# Altium project Zumo LF v2.0.PrjPcb (part 3 of 3)

## Sheet Battery Charger.SchDoc: Battery Charger
size A4; Author: Patryk Bujak; DrawnBy: Patryk Bujak; DocumentNumber: 12; Revision: 1.0; SheetNumber: 8; SheetTotal: 10
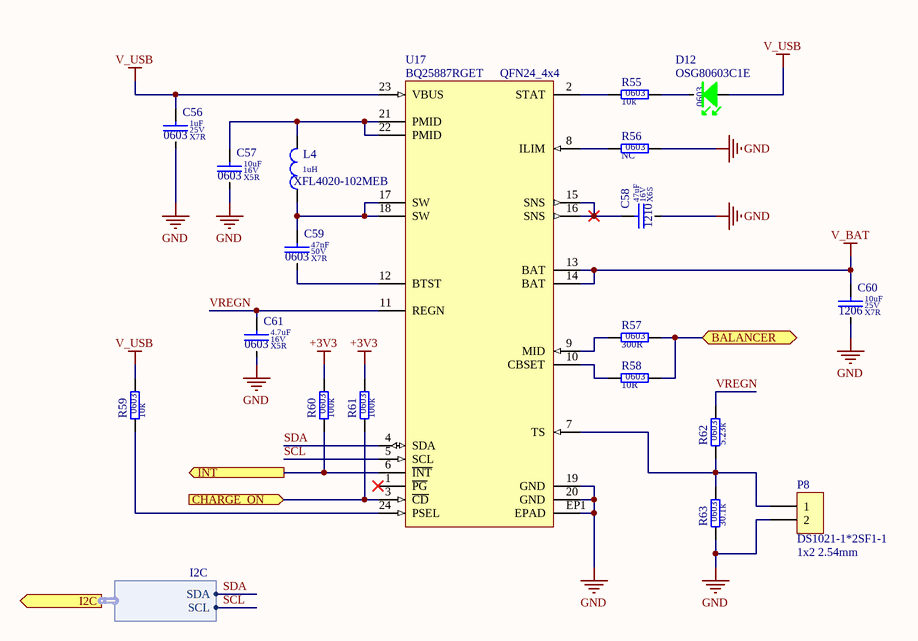
[diagram p9: Battery Charger.SchDoc]

### Parts
C56  value 1uF  Dielectric: X7R  Voltage: 25V  SCH_Footprint: 0603  [C_0603_1608]  (hidden comment: Ceramic X7R)
C57  value 10uF  Dielectric: X5R  Voltage: 16V  SCH_Footprint: 0603  [C_0603_1608]  (hidden comment: Ceramic X5R)
C58  value 47uF  Dielectric: X6S  Voltage: 16V  SCH_Footprint: 1210  [C_1210_3225]  (hidden comment: Ceramic X6S)
C59  value 47nF  Dielectric: X7R  Voltage: 50V  SCH_Footprint: 0603  [C_0603_1608]  (hidden comment: Ceramic X7R)
C60  value 10uF  Dielectric: X7R  Voltage: 25V  SCH_Footprint: 1206  [C_1206_3216]  (hidden comment: Ceramic X7R)
C61  value 4.7uF  Dielectric: X5R  Voltage: 16V  SCH_Footprint: 0603  [C_0603_1608]  (hidden comment: Ceramic X5R)
D12  value OSG80603C1E  SCH_Footprint: 0603  [OL_0603_1608]  (hidden comment: Green led)
L4  value 1uH  SCH_Footprint: XFL4020-102MEB  [XFL4020]  (hidden comment: Inductor)
P8  value DS1021-1*2SF1-1  SCH_Footprint: 1x2 2.54mm  [P_HEADER_1x2_2.54]  (hidden comment: Goldpin)
R55  value 10k  SCH_Footprint: 0603  [R_0603_1608]  (hidden comment: Resistor)
R56  value NC  SCH_Footprint: 0603  [R_NC_0603_1608]  (hidden comment: Resistor)
R57  value 300R  SCH_Footprint: 0603  [R_0603_1608]  (hidden comment: Resistor)
R58  value 10R  SCH_Footprint: 0603  [R_0603_1608]  (hidden comment: Resistor)
R59  value 10k  SCH_Footprint: 0603  [R_0603_1608]  (hidden comment: Resistor)
R60  value 100k  SCH_Footprint: 0603  [R_0603_1608]  (hidden comment: Resistor)
R61  value 100k  SCH_Footprint: 0603  [R_0603_1608]  (hidden comment: Resistor)
R62  value 5.23k  SCH_Footprint: 0603  [R_0603_1608]  (hidden comment: Resistor)
R63  value 30.1k  SCH_Footprint: 0603  [R_0603_1608]  (hidden comment: Resistor)
U17  value BQ25887RGET  [QFN24_4x4]  (hidden comment: BQ25887 I2C Controlled 2-Cell, 2-A Boost-Mode Battery Charger With Cell Balancing For USB Input)

### Ports
BALANCER (bidir), CHARGE_ON (in), I2C (out, harness I2C), INT (out)

### Harnesses
I2C: SDA, SCL

### Nets
+3V3: R60.2 R61.2
GND: C56.2 C57.2 C58.2 C60.2 C61.2 P8.2 R56.2 R63.1 U17.19(GND) U17.20(GND) U17.EP1(EPAD)
V_BAT: C60.1 U17.13(BAT) U17.14(BAT)
V_USB: C56.1 D12.2(A) R59.2 U17.23(VBUS)
SCL: U17.5(SCL) ; port I2C.SCL  [project net BCM3/SCL]
SDA: U17.4(SDA) ; port I2C.SDA  [project net BCM2/SDA]
VREGN: C61.1 R62.2 U17.11(REGN)
NetC57_1: C57.1 L4.2 U17.21(PMID) U17.22(PMID)
NetC58_1: C58.1 U17.15(SNS) U17.16(SNS)
NetC59_1: C59.1 L4.1 U17.17(SW) U17.18(SW)
NetC59_2: C59.2 U17.12(BTST)
NetD12_1: D12.1(K) R55.2
NetJ1_2: R57.2 R58.2 ; port BALANCER
NetP8_1: P8.1 R62.1 R63.2 U17.7(TS)
NetR55_1: R55.1 U17.2(STAT)
NetR56_1: R56.1 U17.8(ILIM)
NetR57_1: R57.1 U17.9(MID)
NetR58_1: R58.1 U17.10(CBSET)
NetR59_1: R59.1 U17.24(PSEL)
NetR60_1: R60.1 U17.6(~{INT}) ; port INT
NetR61_1: R61.1 U17.3(~{CD}) ; port CHARGE_ON

Not connected (* = marked no-connect by the designer): U17 1(~{PG})*

### Notes on the sheet
- Title
- Size:
- Date:
- A4
- Number:
- Time:
- Revision:
- Sheet
- of
- File:

### Library data of the parts
C56 = C_1uF_25V_X7R_0603_10: Capacitor; Manufacturer: Samsung; Manufacturer Part Number: CL10B105KA8NNNC; Tolerance (%): 10; Part Number: C_1uF_25V_X7R_0603_10; HelpURL: http://www.tme.eu/pl/Document/4a42202b32dab16128fe107dd69598cc/samsung-chip-cap.pdf; Supplier 1: TME; Supplier Part Number 1: CL10B105KA8NNNC; Supplier 2: RS Components; Supplier 3: Farnell; Supplier 4: Mouser; Supplier 5: Digi-Key; Supplier 6: LCSC
C57 = C_10uF_16V_X5R_0603_20: Capacitor; Manufacturer: Samsung Electro-Mechanics; Manufacturer Part Number: CL10A106MO8NQNC; Tolerance (%): 20; Part Number: C_10uF_16V_X5R_0603_20; HelpURL: http://www.tme.eu/pl/Document/4a42202b32dab16128fe107dd69598cc/samsung-chip-cap.pdf; Supplier 1: TME; Supplier Part Number 1: CL10A106MO8NQNC; Supplier 2: RS Components; Supplier 3: Farnell; Supplier 4: Mouser; Supplier 5: Digi-Key; Supplier 6: LCSC
C58 = C_47uF_16V_X6S_1210_10: Capacitor; Manufacturer: Murata; Manufacturer Part Number: GRM32EC81C476KE15L; Tolerance (%): 10; Part Number: C_47uF_16V_X6S_1210_10; HelpURL: https://datasheet.octopart.com/GRM32EC81C476KE15L-Murata-datasheet-138746852.pdf; Supplier 1: TME; Supplier 2: RS Components; Supplier Part Number 2: 8467369; Supplier 3: Farnell; Supplier Part Number 3: 1907527; Supplier 4: Mouser; Supplier Part Number 4: 81-GRM32EC81C476KE5L; Supplier 5: Digi-Key; Supplier Part Number 5: 490-10531-1-ND; Supplier 6: LCSC
C59 = C_47nF_50V_X7R_0603_10: Capacitor; Manufacturer: Vishay; Manufacturer Part Number: VJ0603Y473KXACW1BC; Tolerance (%): 10; Part Number: C_47nF_50V_X7R_0603_10; HelpURL: https://www.tme.eu/Document/6a5ad7ac81542ad65ce1ca82bcd21ffa/vjw1bcbascomseries.pdf; Supplier 1: TME; Supplier Part Number 1: VJ0603Y473KXACW1BC; Supplier 2: RS Components; Supplier 3: Farnell; Supplier Part Number 3: 2896456; Supplier 4: Mouser; Supplier Part Number 4: 77-VJ0603Y473KXACBC; Supplier 5: Digi-Key; Supplier Part Number 5: 720-1697-1-ND; Supplier 6: LCSC
C60 = C_10uF_25V_X7R_1206_10: Capacitor; Manufacturer: Samsung Electro-Mechanics; Manufacturer Part Number: CL31B106KAHNNNE; Tolerance (%): 10; Part Number: C_10uF_25V_X7R_1206_10; HelpURL: http://www.tme.eu/pl/Document/4a42202b32dab16128fe107dd69598cc/samsung-chip-cap.pdf; Supplier 1: TME; Supplier Part Number 1: CL31B106KAHNNNE; Supplier 2: RS Components; Supplier 3: Farnell; Supplier 4: Mouser; Supplier 5: Digi-Key; Supplier 6: LCSC
C61 = C_4.7uF_16V_X5R_0603_10: Capacitor; Manufacturer: Murata; Manufacturer Part Number: GRM188R61C475KAAJD; Tolerance (%): 10; Part Number: C_4.7uF_16V_X5R_0603_10; HelpURL: https://datasheet.octopart.com/GRM188R61C475KAAJD-Murata-datasheet-66077093.pdf; Supplier 1: TME; Supplier 2: RS Components; Supplier Part Number 2: 884-7264P; Supplier 3: Farnell; Supplier Part Number 3: 2611924; Supplier 4: Mouser; Supplier Part Number 4: 81-GRM188R61C475KAJD; Supplier 5: Digi-Key; Supplier Part Number 5: 490-10481-2-ND; Supplier 6: LCSC
D12 = OL_G_0603_OSG80603C1E: LED GREEN; Manufacturer: Optosupply; Part Number: OL_G_0603_OSG80603C1E; Manufacturer Part Number: OSG80603C1E; Supplier 1: TME; Supplier Part Number 1: OSG80603C1E; Supplier 2: RS Components; Supplier 3: Farnell; Supplier 4: Mouser; Supplier 5: Digi-Key; Supplier 6: LCSC
L4 = LM_1uH_11A_XFL4020-102MEB: Induction; Manufacturer: Coilcraft; Current: 11A; Resistance: 11.9mR; Part Number: LM_1uH_11A_XFL4020-102MEB; HelpURL: https://datasheet.octopart.com/XFL4020-102MEB-Coilcraft-datasheet-10792328.pdf; Manufacturer Part Number: XFL4020-102MEB; Supplier 1: TME; Supplier 2: RS Components; Supplier 3: Farnell; Supplier 4: Mouser; Supplier Part Number 4: 994-XFL4020-102MEB; Supplier 5: Digi-Key; Supplier 6: LCSC; Supplier 7: Coilcraft; Supplier Part Number 7: XFL4020-102MEB
P8 = P_HEADER_1x2_2.54: Pin Header; Manufacturer: Connfly; Part Number: P_HEADER_1x2_2.54; HelpURL: http://www.tme.eu/en/Document/cc301e58a5da78cb543a94b5a5b7f06a/DS1021.pdf; Manufacturer Part Number: DS1021-1*2SF1-1; Supplier 1: TME; Supplier Part Number 1: ZL201-02G; Supplier 2: RS Components; Supplier 3: Farnell; Supplier 4: Mouser; Supplier 5: Digi-Key; Supplier 6: LCSC
R55 R59 = R_10k_0603_1: Manufacturer: Vishay; Manufacturer Part Number: CRCW060310K0FKTABC; Voltage: 75V; Power: 100mW; Tolerance: 1%; Part Number: R_10k_0603_1; HelpURL: http://www.tme.eu/pl/Document/622e28308c06d160637f2b14751ba16b/Data%20Sheet%20CRCW_BCe3.pdf; Supplier 1: TME; Supplier Part Number 1: CRCW060310K0FKTABC; Supplier 2: RS Components; Supplier 3: Farnell; Supplier 4: Mouser; Supplier Part Number 4: 667-ERJ-3EKF1002V; Supplier 5: Digi-Key; Supplier Part Number 5: P10KGCT-ND; Supplier 6: LCSC
R56 = R_GENERIC_0603: Part Number: R_GENERIC_0603; Supplier 1: TME; Supplier 2: RS Components; Supplier 3: Farnell; Supplier 4: Mouser; Supplier 5: Digi-Key; Supplier 6: LCSC
R57 = R_300R_0603_1: Manufacturer: Yageo; Manufacturer Part Number: RC0603FR-07300RL; Voltage: 50V; Power: 100mW; Tolerance: 1%; Part Number: R_300R_0603_1; HelpURL: https://www.tme.eu/Document/d2a72e545e5c8eb7bf2a04fa97535928/rc0603yageo.pdf; Supplier 1: TME; Supplier Part Number 1: RC0603FR-07300R; Supplier 2: RS Components; Supplier 3: Farnell; Supplier Part Number 3: 2413696; Supplier 4: Mouser; Supplier Part Number 4: 603-RC0603FR-07300RL; Supplier 5: Digi-Key; Supplier Part Number 5: 311-300HRCT-ND; Supplier 6: LCSC
R58 = R_10R_0603_1: Manufacturer: Royalohm; Manufacturer Part Number: 0603SAF100JT5E; Voltage: 50V; Power: 100mW; Tolerance: 1%; Part Number: R_10R_0603_1; HelpURL: http://www.tme.eu/pl/Document/b315665a56acbc42df513c99b390ad98/ROYALOHM-THICKFILM.pdf; Supplier 1: TME; Supplier Part Number 1: SMD0603-10R-1%; Supplier 2: RS Components; Supplier 3: Farnell; Supplier 4: Mouser; Supplier 5: Digi-Key; Supplier 6: LCSC
R60 R61 = R_100k_0603_1: Manufacturer: Royalohm; Manufacturer Part Number: 0603SAF1003T5E; Voltage: 50V; Power: 100mW; Tolerance: 1%; Part Number: R_100k_0603_1; HelpURL: http://www.tme.eu/pl/Document/b315665a56acbc42df513c99b390ad98/ROYALOHM-THICKFILM.pdf; Supplier 1: TME; Supplier Part Number 1: SMD0603-100K-1%; Supplier 2: RS Components; Supplier 3: Farnell; Supplier 4: Mouser; Supplier Part Number 4: 667-ERJ-3EKF1003V; Supplier 5: Digi-Key; Supplier Part Number 5: P100KHCT-ND; Supplier 6: LCSC
R62 = R_5.23k_0603_1: Manufacturer: Royalohm; Manufacturer Part Number: 0603SAF5232T5E; Voltage: 50V; Power: 100mW; Tolerance: 1%; Part Number: R_5.23k_0603_1; HelpURL: https://www.tme.eu/Document/9e42ba54d36a9bd3dfa2901986ac022d/rezystor-smd.pdf; Supplier 1: TME; Supplier Part Number 1: SMD0603-52.3K-1%; Supplier 2: RS Components; Supplier 3: Farnell; Supplier 4: Mouser; Supplier 5: Digi-Key; Supplier 6: LCSC
R63 = R_30.1k_0603_1: Manufacturer: Vishay; Manufacturer Part Number: CRCW060330K1FKTABC; Voltage: 75V; Power: 100mW; Tolerance: 1%; Part Number: R_30.1k_0603_1; HelpURL: https://www.tme.eu/Document/622e28308c06d160637f2b14751ba16b/Data%20Sheet%20CRCW_BCe3.pdf; Supplier 1: TME; Supplier Part Number 1: CRCW060330K1FKTABC; Supplier 2: RS Components; Supplier 3: Farnell; Supplier 4: Mouser; Supplier Part Number 4: 71-CRCW0603-30.1K; Supplier 5: Digi-Key; Supplier Part Number 5: CRCW060330K1FKTA-ND; Supplier 6: LCSC
U17 = U_BQ25887RGET: Manufacturer: Texas Instruments; SCH_Footprint: QFN24_4x4; Part Number: U_BQ25887RGET; HelpURL: http://www.ti.com/lit/ds/symlink/bq25887.pdf; Manufacturer Part Number: BQ25887RGET; Supplier 1: TME; Supplier 2: RS Components; Supplier 3: Farnell; Supplier 4: Mouser; Supplier Part Number 4: 595-BQ25887RGET; Supplier 5: Digi-Key; Supplier Part Number 5: 296-53518-1-ND; Supplier 6: LCSC

## Nets that join several sheets
+3V3: SENS (J4.2), Power (6 pins), Motor Driver (5 pins), CPU (19 pins), IMU (12 pins), ESP32 (C40.1 U11.3 U11.7), RPi (C35.1 U9.3 U9.7), Input_Output (9 pins), Battery Charger (R60.2 R61.2)
+3V3_ESP: Power (C21.1 U6.4), ESP32 (9 pins)
+5V: SENS (J4.1), Power (14 pins), ESP32 (D10.1), RPi (U10.4 U10.7 U10.8), Input_Output (D1.2 J6.3 P5.1)
+6V: Power (6 pins), Motor Driver (C33.1 U8.12)
GND: SENS (J4.12), Power (38 pins), Motor Driver (7 pins), CPU (24 pins), IMU (27 pins), ESP32 (36 pins), RPi (28 pins), Input_Output (12 pins), Battery Charger (11 pins)
V_BAT: Power (J1.1 P2.1 S2.3), Battery Charger (C60.1 U17.13 U17.14)
V_USB: ESP32 (12 pins), Battery Charger (C56.1 D12.2 R59.2 U17.23)
BCM2/SDA: CPU (R53.1 U7.62), IMU (U14.24 U16.3 U19.1), ESP32 (U11.8), RPi (MOD3.3 P1.3), Battery Charger (U17.4)
BCM3/SCL: CPU (R50.1 U7.61), IMU (U14.23 U16.4 U19.8), ESP32 (U11.1), RPi (MOD3.5 P1.5), Battery Charger (U17.5)
EN_PWR_RPI: RPi (R30.2 R31.2 U9.6 U10.6), Input_Output (S1.6)
FAULT: Motor Driver (D8.1 R26.1 U8.8), CPU (U7.36)
INT_BHI: CPU (U7.28), IMU (U14.12)
INT_ICM: CPU (U7.24), IMU (U15.12)
MOT_L_FB1: Motor Driver (P4.7), CPU (U7.56)
MOT_L_FB2: Motor Driver (P4.9), CPU (U7.57)
MOT_L_PWM1: Motor Driver (U8.9), CPU (U7.34)
MOT_L_PWM2: Motor Driver (U8.10), CPU (U7.35)
MOT_R_FB1: Motor Driver (P4.8), CPU (U7.58)
MOT_R_FB2: Motor Driver (P4.10), CPU (U7.59)
MOT_R_PWM1: Motor Driver (U8.16), CPU (U7.26)
MOT_R_PWM2: Motor Driver (U8.15), CPU (U7.27)
NetC4_1: CPU (U7.20), Input_Output (C4.1 U1.3)
NetC6_1: Power (C6.1 U2.7), CPU (U7.22)
NetC22_1: Power (C22.1 R13.1 R19.2), CPU (U7.25)
NetJ1_2: Power (J1.2), Battery Charger (R57.2 R58.2)
NetJ4_11: SENS (J4.11), CPU (U7.3)
NetM1_24: CPU (R64.2), ESP32 (M1.24)
NetR7_1: Power (R7.1), CPU (U7.33)
NetR10_2: CPU (R65.2), RPi (R10.2)
NetR11_2: Power (R11.2 U6.1), CPU (U7.4), ESP32 (R44.2 U11.6), Input_Output (S1.4)
NetR60_1: CPU (U7.39), Battery Charger (R60.1 U17.6)
NetR61_1: Input_Output (S1.8), Battery Charger (R61.1 U17.3)
NetS1_7: CPU (U7.37), Input_Output (S1.7)
NetU7_29: CPU (U7.29), Input_Output (U18.4)
NetU7_30: CPU (U7.30), Input_Output (U18.5)
PG+3V3: Power (R17.1 U5.3), CPU (U7.2)
PG+3V3_ESP: Power (R18.1 U6.3), CPU (U7.40)
PG+5V: Power (R16.1 U4.5), CPU (U7.38)
PG+6V: Power (R15.1 U3.5), CPU (U7.45)
RXD: CPU (U7.51), ESP32 (M1.27)
SENS1: SENS (J4.3), CPU (U7.17)
SENS2: SENS (J4.4), CPU (U7.16)
SENS3: SENS (J4.5), CPU (U7.15)
SENS4: SENS (J4.6), CPU (U7.14)
SENS5: SENS (J4.7), CPU (U7.11)
SENS6: SENS (J4.8), CPU (U7.10)
SENS7: SENS (J4.9), CPU (U7.9)
SENS8: SENS (J4.10), CPU (U7.8)
TXD: CPU (U7.52), ESP32 (M1.28)
USART2_RX: CPU (U7.54), RPi (U9.5)
USART2_TX: CPU (U7.53), RPi (U9.4)
WS2812B: CPU (U7.21), Input_Output (D7.4)